# EAGLE schematic experimento1 (EAGLE 9.3.1)
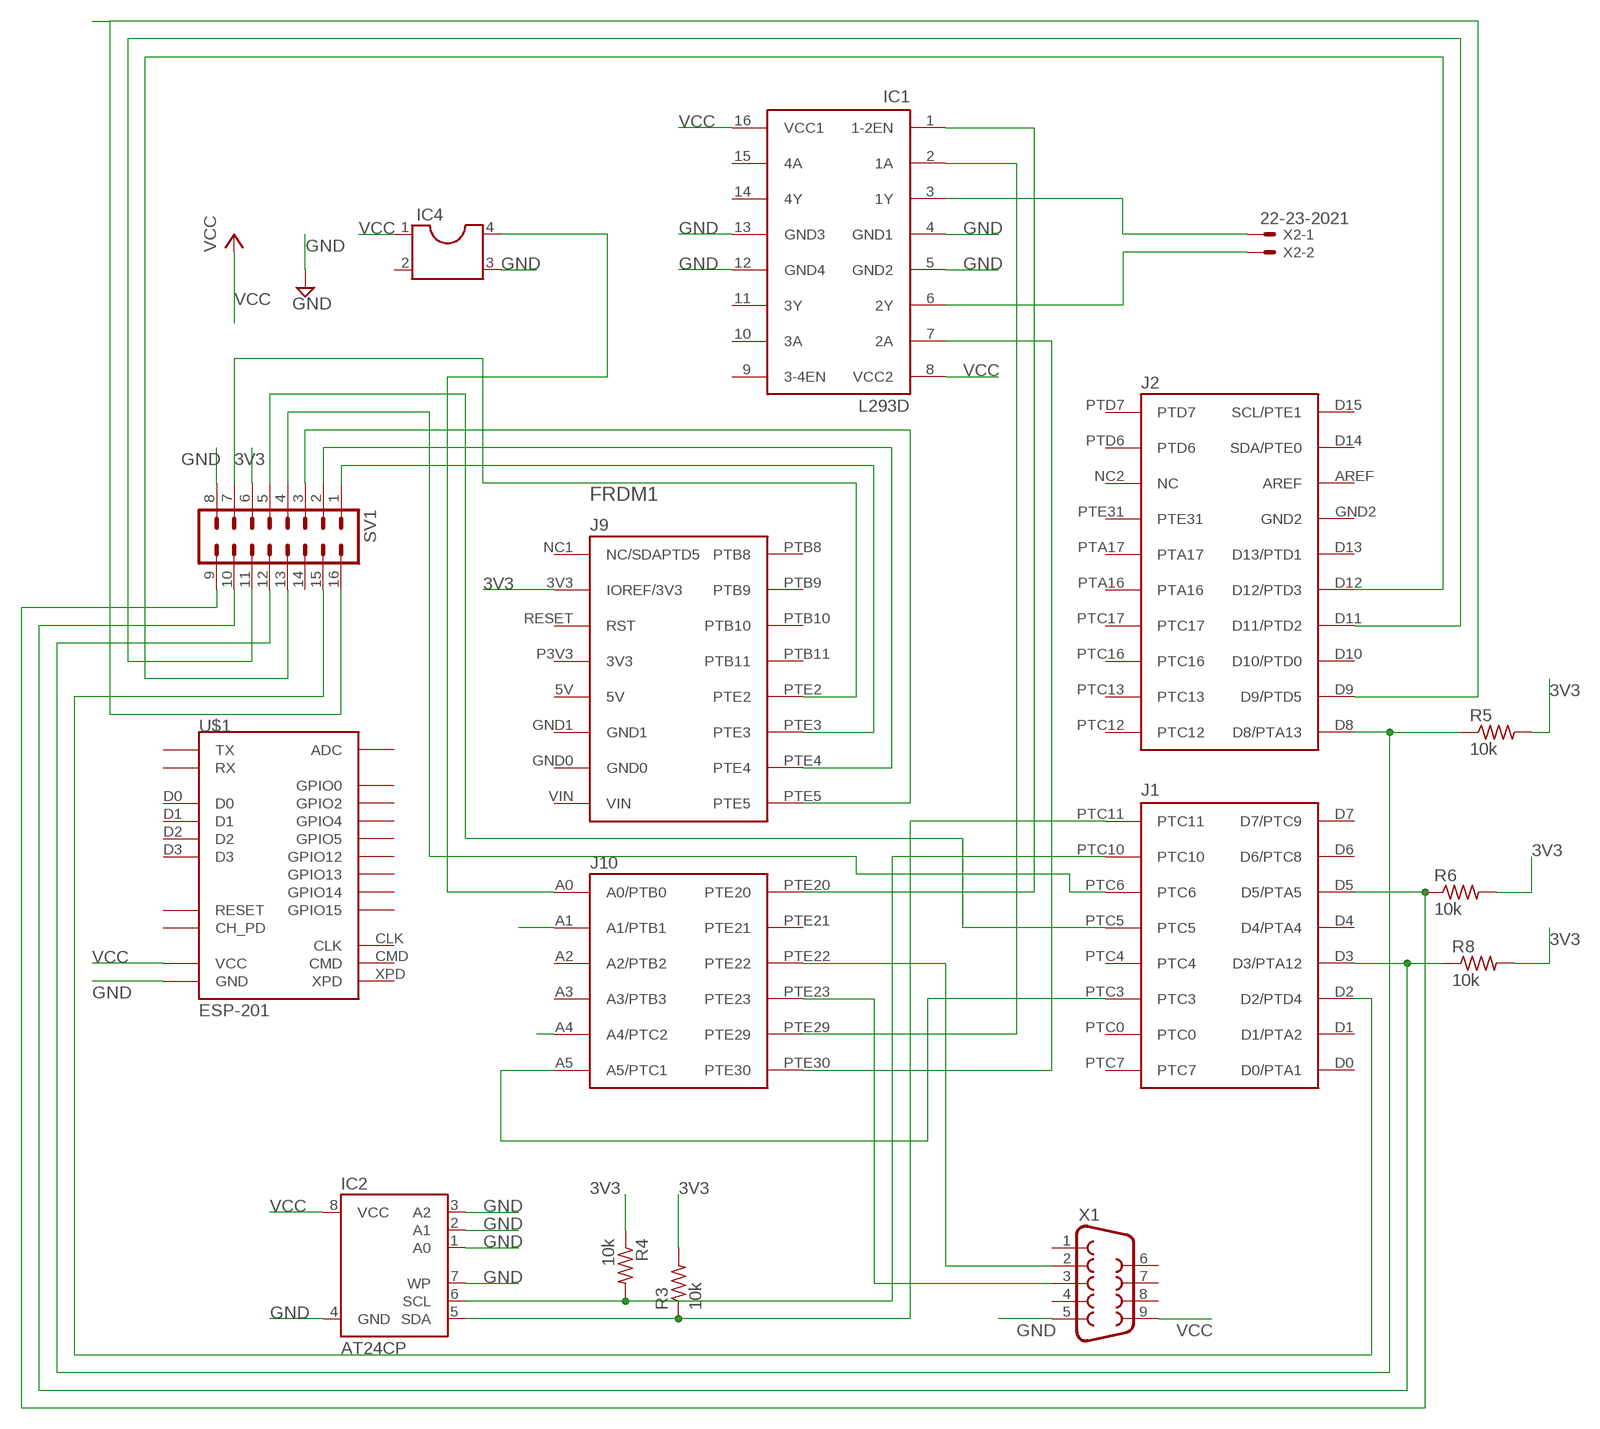
[diagram p0: schematic, sheet 1]

## Parts
FRDM1  FRDM-KL25ZNORMAL  [FRDM_KL25Z_NORMAL]
IC1  L293D  [DIL16]
IC2  AT24CP  [DIL08]
IC4  DIL4  [DIL04]
R3  10k  R-US_0204/2V  [0204V]
R4  10k  R-US_0204/2V  [0204V]
R5  10k  R-US_0204/2V  [0204V]
R6  10k  R-US_0204/2V  [0204V]
R8  10k  R-US_0204/2V  [0204V]
SV1  IC16PL  [IC16PL]
U$1  ESP-201  [ESP-201]
X1  F09D  [F09D]
X2  22-23-2021  [22-23-2021]

## Nets
3V3: FRDM1.3V3(IOREF/3V3) R3.2 R4.1 R5.2 R6.2 R8.2 SV1.6
GND: IC1.4(GND1) IC1.5(GND2) IC1.12(GND4) IC1.13(GND3) IC2.1(A0) IC2.2(A1) IC2.3(A2) IC2.4(GND) IC2.7(WP) IC4.3 SV1.8 U$1.GND U$1.GND_2(GND) U$1.GND_3(GND) X1.5
N$1: FRDM1.A5(A5/PTC1) FRDM1.PTC3
N$2: FRDM1.PTE20 IC1.1(1-2EN)
N$3: FRDM1.A1(A1/PTB1)
N$4: FRDM1.PTE29 IC1.2(1A)
N$5: FRDM1.A4(A4/PTC2)
N$6: FRDM1.PTE30 IC1.7(2A)
N$7: FRDM1.PTE22 X1.2
N$8: FRDM1.PTC11 IC2.5(SDA) R3.1
N$9: FRDM1.PTC10 IC2.6(SCL) R4.2
N$10: IC1.3(1Y) X2.1
N$11: FRDM1.PTE3 SV1.1
N$12: IC1.6(2Y) X2.2
N$13: FRDM1.PTE4 SV1.2
N$14: FRDM1.A0(A0/PTB0) IC4.4
N$15: FRDM1.PTE5 SV1.3
N$16: FRDM1.PTE23 X1.3
N$17: FRDM1.PTC6 SV1.4
N$18: FRDM1.PTC5 SV1.5
N$19: FRDM1.PTE2 SV1.7
N$20: FRDM1.D5(D5/PTA5) R6.1 SV1.9
N$21: FRDM1.D3(D3/PTA12) R8.1 SV1.10
N$22: FRDM1.D8(D8/PTA13) R5.1 SV1.12
N$23: FRDM1.D11(D11/PTD2) SV1.11
N$24: FRDM1.D12(D12/PTD3) SV1.13
N$25: FRDM1.D2(D2/PTD4) SV1.15
N$26: FRDM1.D9(D9/PTD5) SV1.16
VCC: IC1.8(VCC2) IC1.16(VCC1) IC2.8(VCC) IC4.1 U$1.3V3(VCC) U$1.3V3_2(VCC) U$1.3V3_3(VCC) X1.9
Unconnected: FRDM1.5V FRDM1.A2(A2/PTB2) FRDM1.A3(A3/PTB3) FRDM1.AREF FRDM1.D0(D0/PTA1) FRDM1.D1(D1/PTA2) FRDM1.D4(D4/PTA4) FRDM1.D6(D6/PTC8) FRDM1.D7(D7/PTC9) FRDM1.D10(D10/PTD0) FRDM1.D13(D13/PTD1) FRDM1.D14(SDA/PTE0) FRDM1.D15(SCL/PTE1) FRDM1.GND0 FRDM1.GND1 FRDM1.GND2 FRDM1.NC1(NC/SDAPTD5) FRDM1.NC2(NC) FRDM1.P3V3(3V3) FRDM1.PTA16 FRDM1.PTA17 FRDM1.PTB8 FRDM1.PTB9 FRDM1.PTB10 FRDM1.PTB11 FRDM1.PTC0 FRDM1.PTC4 FRDM1.PTC7 FRDM1.PTC12 FRDM1.PTC13 FRDM1.PTC16 FRDM1.PTC17 FRDM1.PTD6 FRDM1.PTD7 FRDM1.PTE21 FRDM1.PTE31 FRDM1.RESET(RST) FRDM1.VIN IC1.9(3-4EN) IC1.10(3A) IC1.11(3Y) IC1.14(4Y) IC1.15(4A) IC4.2 SV1.14 U$1.ADC U$1.CH_PD U$1.CLK U$1.CMD U$1.D0 U$1.D1 U$1.D2 U$1.D3 U$1.GPIO0 U$1.GPIO2 U$1.GPIO4 U$1.GPIO5 U$1.GPIO12 U$1.GPIO13 U$1.GPIO14 U$1.GPIO15 U$1.RST(RESET) U$1.RX U$1.TX U$1.XPD X1.1 X1.4 X1.6 X1.7 X1.8

## Library data of the parts
FRDM1 = Freedom:FRDM-KL25Z: For creating FRDM-KL25Z shields
IC1 = st-microelectronics:L293D: PUSH-PULL 4 CHANNEL DRIVER; MPN: L293D; OC_FARNELL: 9589619; OC_NEWARK: 56P8249
IC2 = atmel:AT24C*: 2-wire serial EEPROM; MPN: AT24C1024BW-SH-B; OC_FARNELL: 1362646; OC_NEWARK: 03P2044
IC4 = ic-package:DIL4: Dual In Line / Socket
R3-R6 R8 = rcl:R-US_: RESISTOR, American symbol; SPICEPREFIX: R
SV1 = con-dil:IC16PL: DIL CABLE CONNECTOR
U$1 = esp8266modules:ESP-201: ESP8266 Wifi Module ESP-201; DIMENSIONS: 25 x 35 mm; PINS: 26; PITCH: 0.1" / 2.54 mm
X1 = con-subd:F09: SUB-D; OC_FARNELL: unknown; OC_NEWARK: unknown
X2 = con-molex:22-23-2021: .100" (2.54mm) Center Header - 2 Pin; MF: MOLEX; MPN: 22-23-2021; OC_FARNELL: 1462926; OC_NEWARK: 25C3832